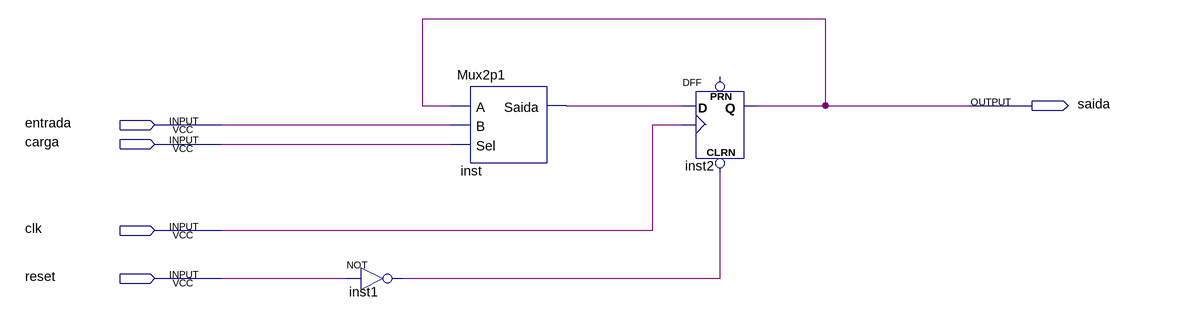
[diagram p0: schematic sheet]
// Quartus schematic Celula_Registrador.bdf as structural Verilog: 3 symbols, 5 pins
module Celula_Registrador (
  input  entrada,
  input  carga,
  input  clk,
  input  reset,
  output saida
);

  wire inst1_out, inst_saida;

  not inst1 (inst1_out, reset);
  Mux2p1 inst (.A(saida), .B(entrada), .Sel(carga), .Saida(inst_saida));
  DFF inst2 (.CLRN(inst1_out), .CLK(clk), .D(inst_saida), .Q(saida));  // open: PRN
endmodule
